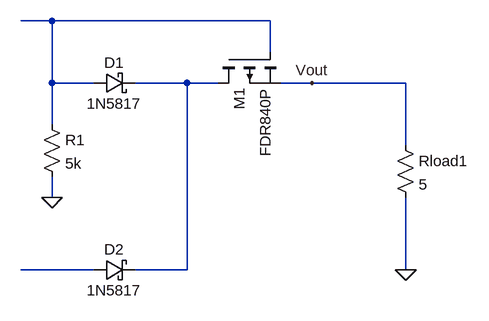
[diagram p0: schematic Draft4.asc]
Draft4.asc, the LTspice schematic file:
Version 4
SHEET 1 880 680
WIRE -128 -64 -176 -64
WIRE 208 -64 -128 -64
WIRE 208 -16 208 -64
WIRE -128 32 -128 -64
WIRE -64 32 -128 32
WIRE 80 32 0 32
WIRE 128 32 80 32
WIRE 272 32 224 32
WIRE 416 32 272 32
WIRE -128 96 -128 32
WIRE 416 128 416 32
WIRE -128 208 -128 176
WIRE -64 320 -176 320
WIRE 80 320 80 32
WIRE 80 320 0 320
WIRE 416 320 416 208
FLAG -128 208 0
FLAG 272 32 Vout
FLAG 416 320 0
DATAFLAG -128 320 ""
DATAFLAG 416 32 ""
DATAFLAG 128 -64 "$-V(N001)"
SYMBOL res -144 80 R0
SYMATTR InstName R1
SYMATTR Value 5k
SYMBOL pmos 128 -16 M90
SYMATTR InstName M1
SYMATTR Value FDR840P
SYMBOL schottky -64 16 M90
WINDOW 0 0 32 VBottom 2
WINDOW 3 32 32 VTop 2
SYMATTR InstName D1
SYMATTR Value 1N5817
SYMBOL schottky -64 336 R270
WINDOW 0 32 32 VTop 2
WINDOW 3 0 32 VBottom 2
SYMATTR InstName D2
SYMATTR Value 1N5817
SYMBOL res 400 112 R0
SYMATTR InstName Rload1
SYMATTR Value 5

The netlist it stands for:
* Draft4.asc
R1 N001 0 5k
M1 N002 N001 Vout Vout FDR840P
D1 N001 N002 1N5817
D2 N003 N002 1N5817
Rload1 Vout 0 5
.model D D
.lib standard.dio
.model NMOS NMOS
.model PMOS PMOS
.lib standard.mos
.backanno
.end